# Altium schematic sheet SYSTEM.SchDoc
size 193 x 146 mm
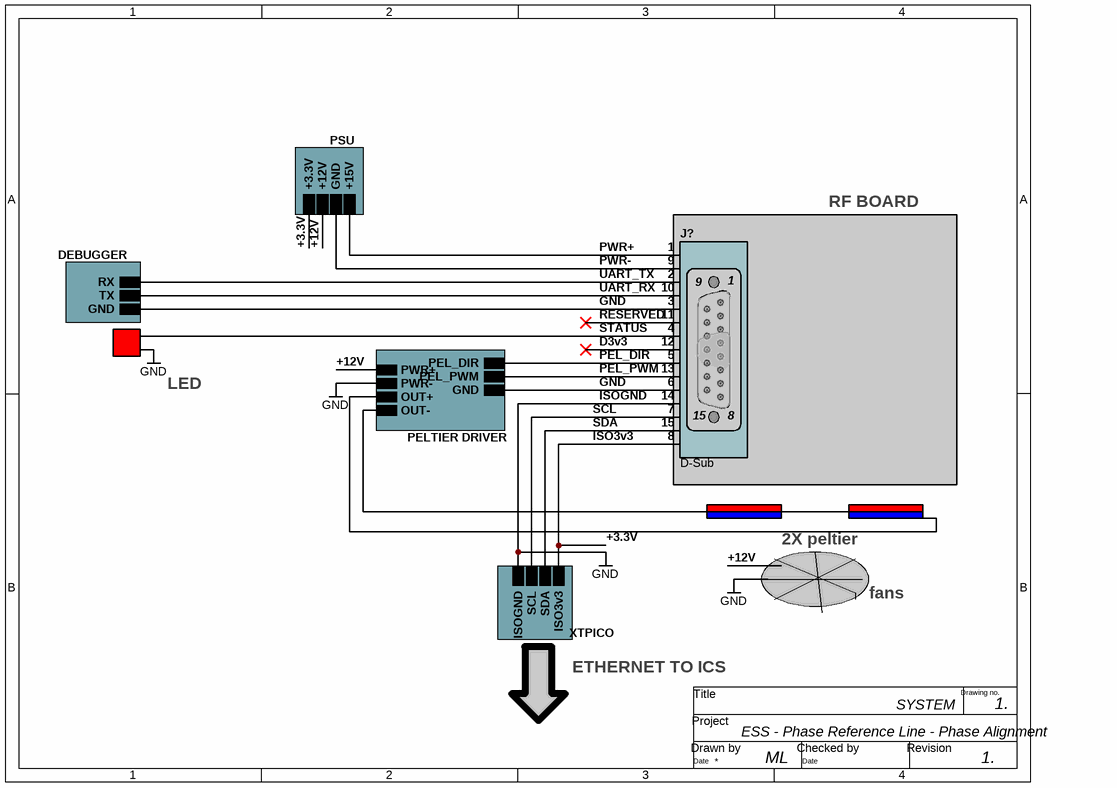
[diagram p0: SYSTEM.SchDoc]

## Parts
J?  D-Sub  [773-E15-113]

## Blocks framed on the sheet
RF BOARD: J?

## Sub-sheets
DEBUGGER = File Name: RX, TX, GND
PELTIER DRIVER = File Name: PEL_PWM, PEL_DIR, GND, PWR+, PWR-, OUT+, OUT-
PSU = File Name: +15V, GND, +12V, +3.3V
XTPICO = File Name: ISO3v3, SDA, SCL, ISOGND

## Nets
GND: J?.3 J?.6 J?.14 ; sheet XTPICO/ISOGND, sheet DEBUGGER/GND, sheet PELTIER DRIVER/GND, sheet PELTIER DRIVER/PWR-  [also labelled ISOGND]
+3.3V: J?.8 ; sheet PSU/+3.3V, sheet XTPICO/ISO3v3  [also labelled ISO3v3]
+12V: sheet PSU/+12V, sheet PELTIER DRIVER/PWR+
D3v3: J?.12
PEL_DIR: J?.5 ; sheet PELTIER DRIVER/PEL_DIR
PEL_PWM: J?.13 ; sheet PELTIER DRIVER/PEL_PWM
PWR+: J?.1 ; sheet PSU/+15V
PWR-: J?.9 ; sheet PSU/GND
RESERVED: J?.11
SCL: J?.7 ; sheet XTPICO/SCL
SDA: J?.15 ; sheet XTPICO/SDA
STATUS: J?.4
UART_RX: J?.10 ; sheet DEBUGGER/TX
UART_TX: J?.2 ; sheet DEBUGGER/RX

## Notes on the sheet
- LED
- 2X peltier
- fans
- ETHERNET TO ICS
- ESS - Phase Reference Line - Phase Alignment
- SYSTEM
- 1.
- ML
- Title
- Project
- Drawing no.
- Date
- Drawn by
- Checked by
- Revision

## Library data of the parts
J? = 773-E15-113R011: 15 Position D-Sub Plug, Male Pins Connector; HelpURL: https://media.digikey.com/pdf/Data%20Sheets/Norcomp%20PDFs/773-EYY-113RYY1_rev5.pdf; Supplier 1: Digi-Key; Supplier Part Number 1: NOR1069-ND